# Altium schematic sheet Sheet1.SchDoc
size A4
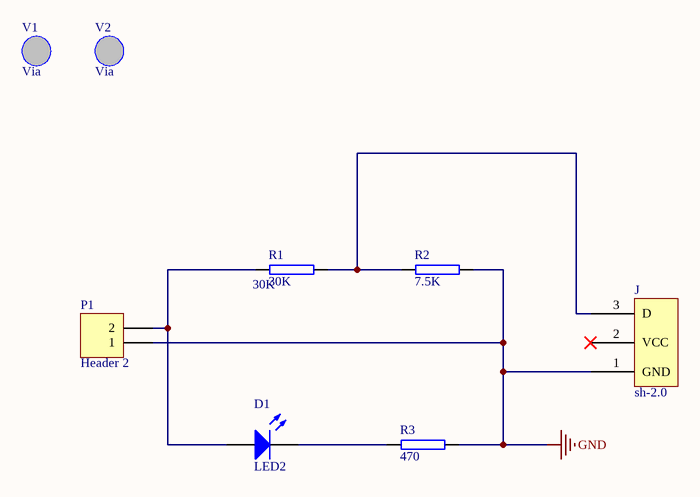
[diagram p0: Sheet1.SchDoc]

## Parts
D1  LED2  [3.2X1.6X1.1]
J  sh-2.0  [sh-2.0]
P1  Header 2  [DIP2]
R1  30K  [1608[0603]]
R2  7.5K  [1608[0603]]
R3  470  [1608[0603]]
V1  Via  [Via]
V2  Via  [Via]

## Nets
GND: J.1(GND) P1.1 R2.2 R3.2
NetD1_1: D1.1(A) P1.2 R1.1
NetD1_2: D1.2(K) R3.1
NetJ_3: J.3(D) R1.2 R2.1

Not connected (* = marked no-connect by the designer): J 2(VCC)*

## Library data of the parts
D1 = LED2: Typical RED, GREEN, YELLOW, AMBER GaAs LED; Published: 8-Jun-2000; LatestRevisionDate: 17-Jul-2002; LatestRevisionNote: Re-released for DXP Platform.; PackageVersion: Feb-2002; PackageReference: 3.2X1.6X1.1; Publisher: Altium Limited; PackageDescription: SM LED; 2 Flat Leads
J = sh-2.0: pin to pad: 1>3 3>1
P1 = Header 2: Header, 2-Pin; LatestRevisionDate: 17-Jul-2002; LatestRevisionNote: Re-released for DXP Platform.; Publisher: Altium Limited
R1-R3 = RES